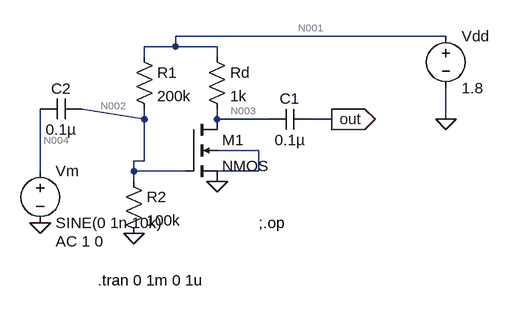
[diagram p0: schematic Draft1.asc]
Draft1.asc, the LTspice schematic file:
Version 4
SHEET 1 880 680
WIRE 576 -64 160 -64
WIRE 160 -48 160 -64
WIRE 160 -48 112 -48
WIRE 224 -48 160 -48
WIRE 112 -32 112 -48
WIRE 224 -32 224 -48
WIRE 112 64 16 48
WIRE 112 64 112 48
WIRE 224 64 224 48
WIRE 304 64 224 64
WIRE 400 64 368 64
WIRE 576 64 576 16
WIRE 288 112 224 112
WIRE 112 128 112 64
WIRE 112 128 96 128
WIRE -48 144 -48 48
WIRE 96 144 96 128
WIRE 176 144 96 144
WIRE 288 144 288 112
WIRE 288 144 224 144
WIRE 96 160 96 144
WIRE 224 160 224 144
FLAG 224 160 0
FLAG 96 240 0
FLAG -48 224 0
FLAG 576 64 0
FLAG 400 64 out
IOPIN 400 64 Out
SYMBOL nmos4 176 64 R0
SYMATTR InstName M1
SYMATTR Value2 l=1u w=416u
SYMBOL res 208 -48 R0
SYMATTR InstName Rd
SYMATTR Value 1k
SYMBOL res 96 -48 R0
SYMATTR InstName R1
SYMATTR Value 200k
SYMBOL res 80 144 R0
SYMATTR InstName R2
SYMATTR Value 100k
SYMBOL cap 368 48 R90
WINDOW 0 0 32 VBottom 2
WINDOW 3 32 32 VTop 2
SYMATTR InstName C1
SYMATTR Value 0.1µ
SYMBOL cap 16 32 R90
WINDOW 0 0 32 VBottom 2
WINDOW 3 32 32 VTop 2
SYMATTR InstName C2
SYMATTR Value 0.1µ
SYMBOL voltage -48 128 R0
WINDOW 123 24 124 Left 2
WINDOW 39 0 0 Left 0
SYMATTR InstName Vm
SYMATTR Value SINE(0 1n 10k)
SYMATTR Value2 AC 1 0
SYMBOL voltage 576 -80 R0
WINDOW 123 0 0 Left 0
WINDOW 39 0 0 Left 0
SYMATTR InstName Vdd
SYMATTR Value 1.8
TEXT 288 224 Left 2 !;.op
TEXT 40 312 Left 2 !.tran 0 1m 0 1u

The netlist it stands for:
* Draft1.asc
M1 N003 N002 0 0 NMOS l=1u w=416u
Rd N001 N003 1k
R1 N001 N002 200k
R2 N002 0 100k
C1 out N003 0.1µ
C2 N002 N004 0.1µ
Vm N004 0 SINE(0 1n 10k) AC 1 0
Vdd N001 0 1.8
.model NMOS NMOS
.model PMOS PMOS
.lib standard.mos
;.op
.tran 0 1m 0 1u
.backanno
.end

* Results of the author's LTspice run, read from the files saved beside the schematic
* Operating Point, zero values left out:
*   V(n001) = 1.8 V
*   V(n003) = 1.796 V
*   V(n002) = 600 mV
*   V(out) = 179.6 nV
*   Id(M1) = 3.6 µA
*   Ib(M1) = -1.806 pA
*   Is(M1) = -3.6 µA
*   I(R2) = 6 µA
*   I(R1) = 6 µA
*   I(Rd) = 3.6 µA
*   I(Vdd) = -9.6 µA
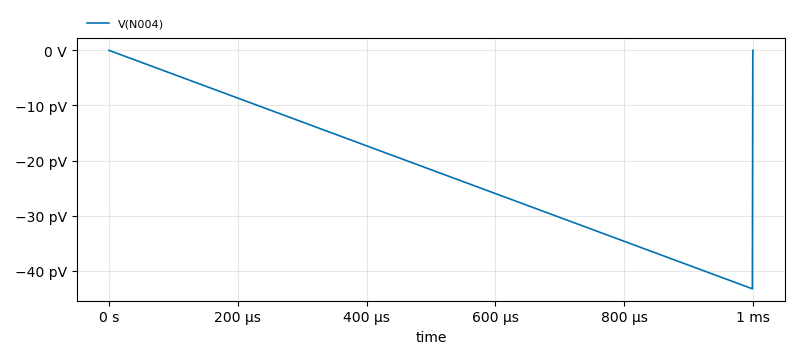
[diagram p1: Transient Analysis of Draft1.asc, plotted from the saved traces]
* Transient Analysis, 1 run:
*   V(N004): min -43.3 pV, max 0 V, average -21.65 pV, rms 30.61 pV, last 0 V